# EAGLE schematic PCB Overview (EAGLE 9.2.0)
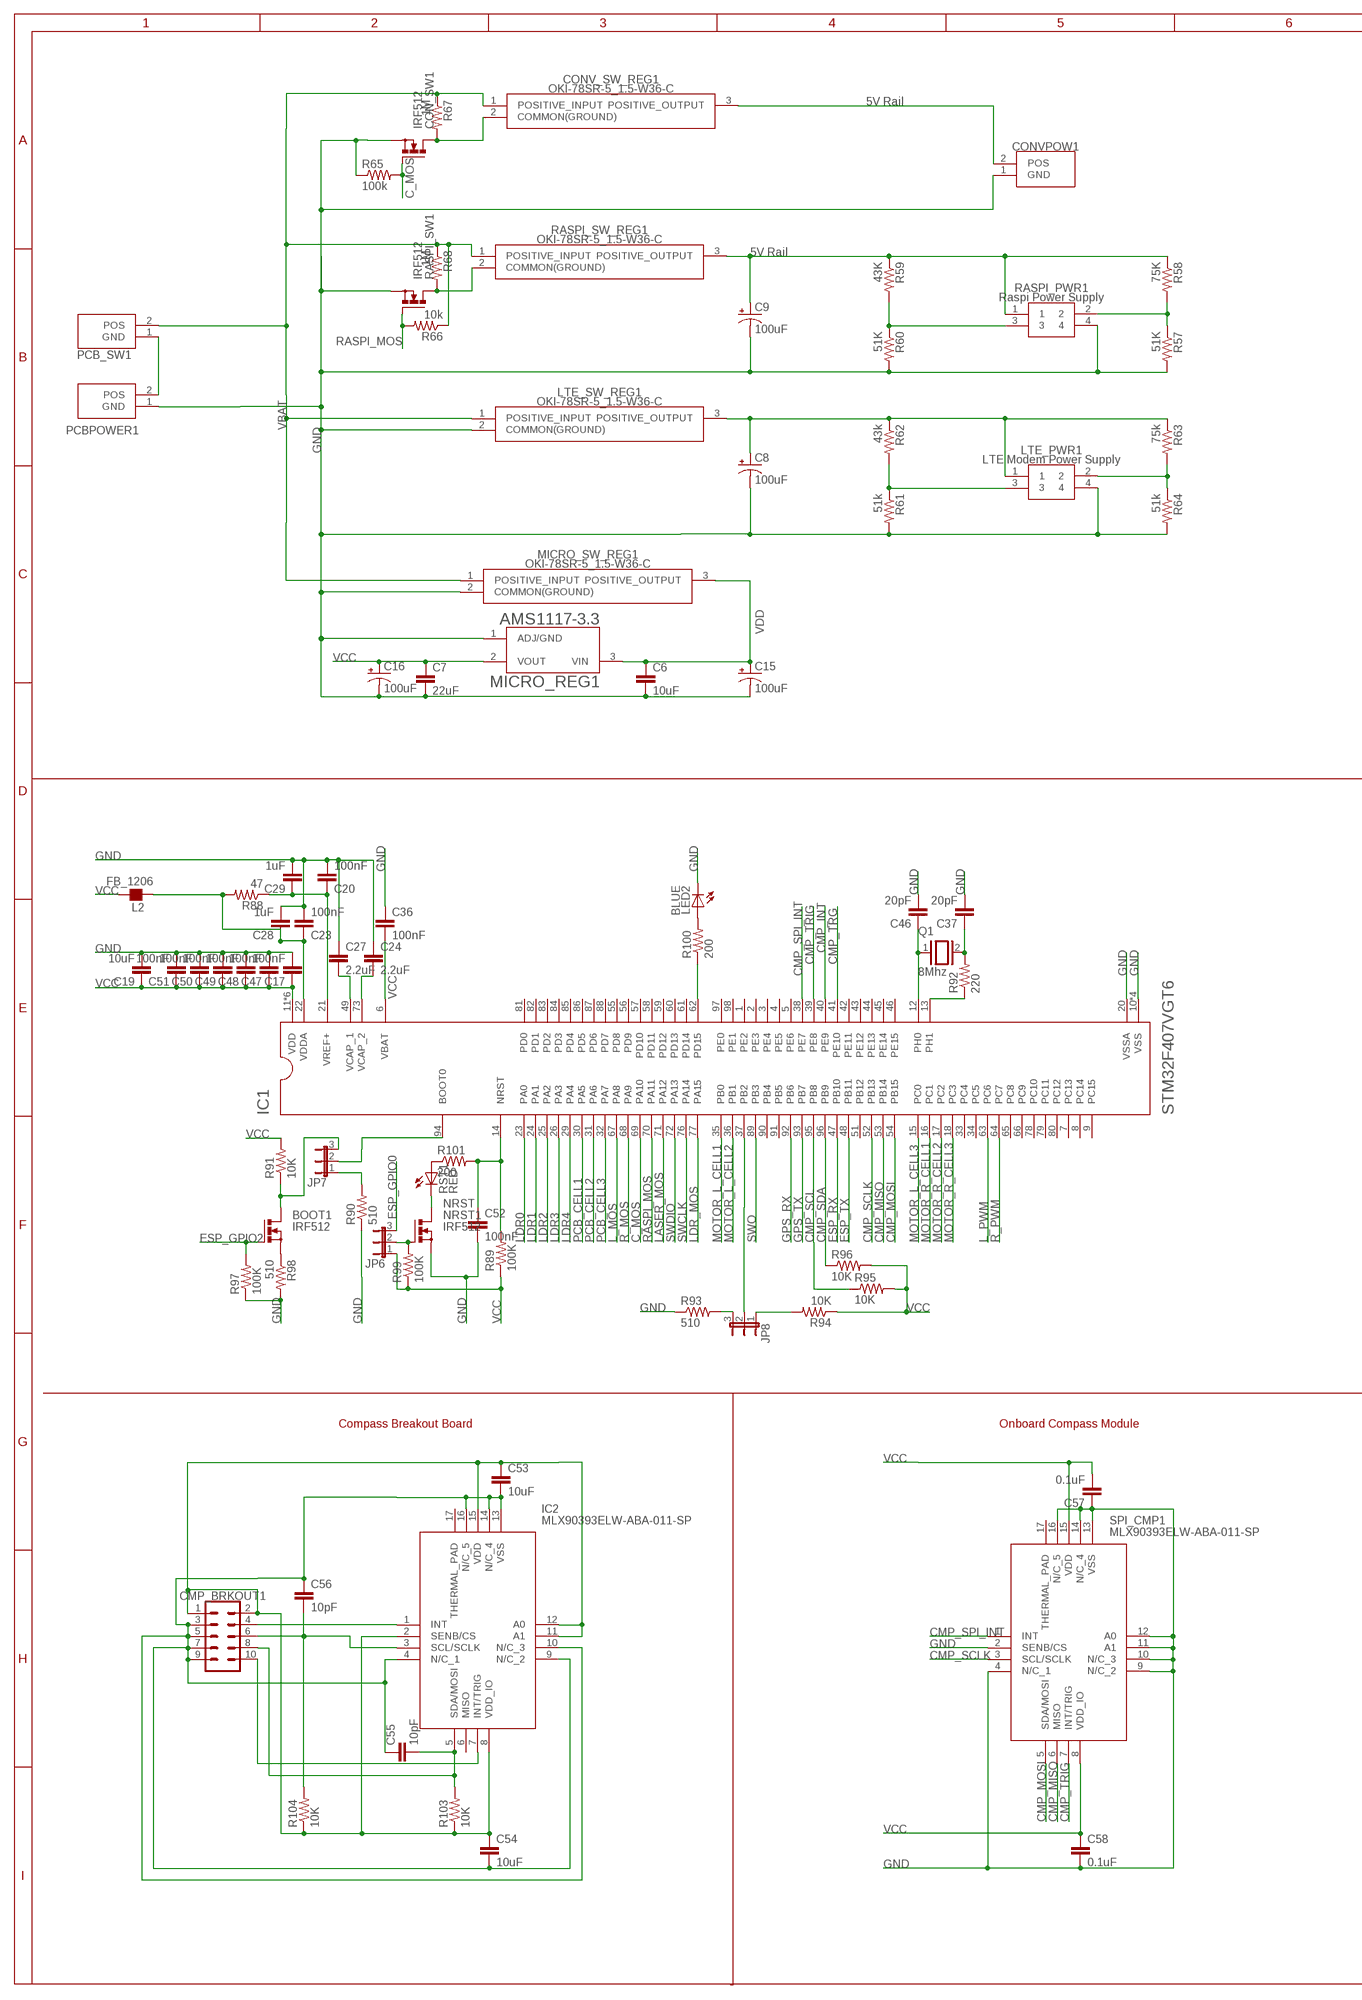
[diagram p0: schematic, sheet 1, part 1 of 2]
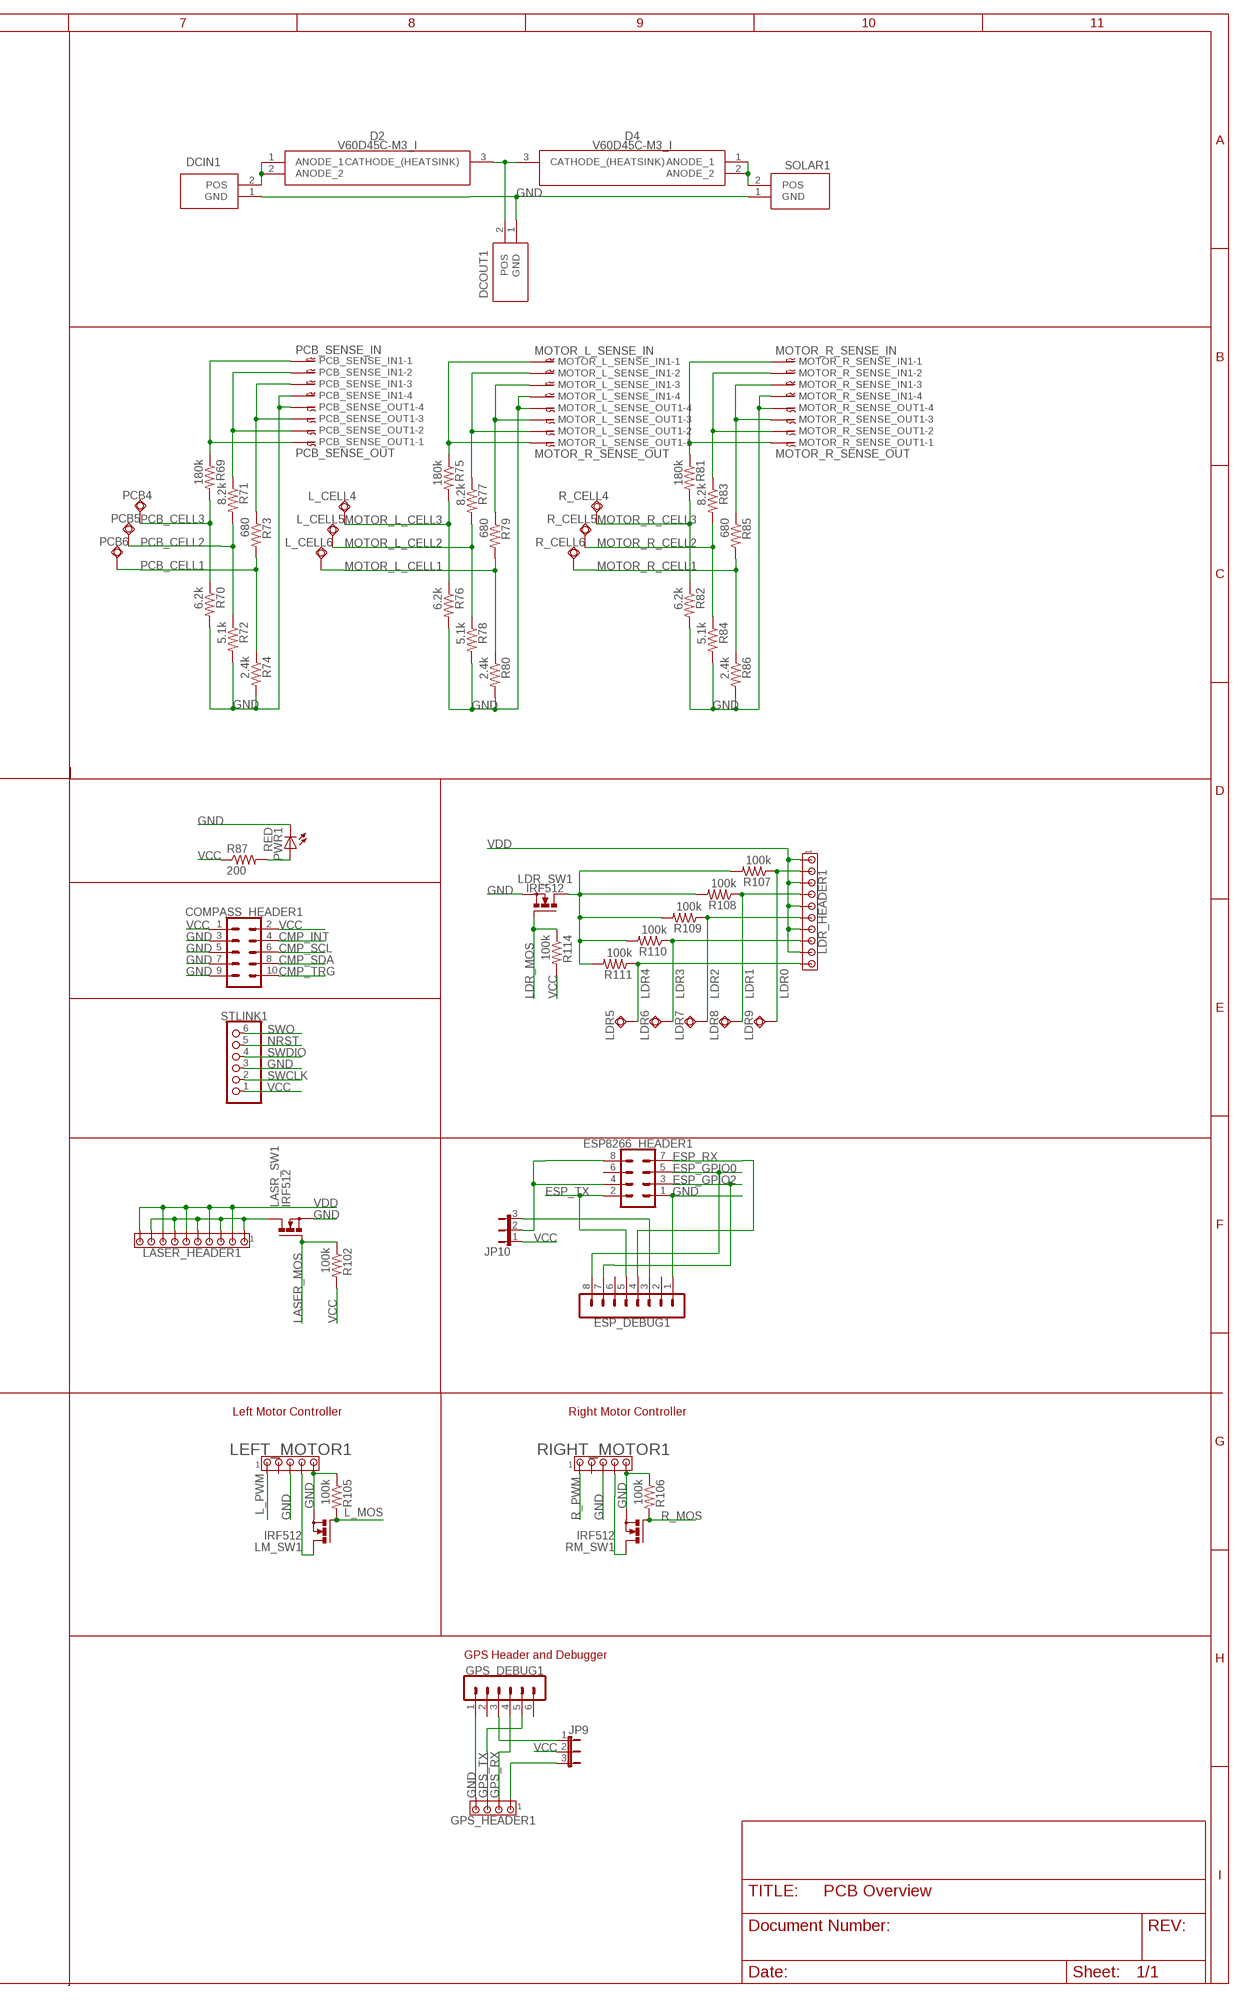
[diagram p1: schematic, sheet 1, part 2 of 2]

## Parts
BOOT1  IRF512  [TO220BV]
C6  10uF  C-EUC0805  [C0805]
C7  22uF  C-EUC0805  [C0805]
C8  100uF  CPOL-US140CLH-0810  [140CLH-0810]
C9  100uF  CPOL-US140CLH-0810  [140CLH-0810]
C15  100uF  CPOL-US140CLH-0810  [140CLH-0810]
C16  100uF  CPOL-US140CLH-0810  [140CLH-0810]
C17  100nF  C-EUC0805  [C0805]
C19  10uF  C-EUC0805  [C0805]
C20  100nF  C-EUC0805  [C0805]
C23  100nF  C-EUC0805  [C0805]
C24  2.2uF  C-EUC0805  [C0805]
C27  2.2uF  C-EUC0805  [C0805]
C28  1uF  C-EUC0805  [C0805]
C29  1uF  C-EUC0805  [C0805]
C36  100nF  C-EUC0805  [C0805]
C37  20pF  C-EUC0805  [C0805]
C46  20pF  C-EUC0805  [C0805]
C47  100nF  C-EUC0805  [C0805]
C48  100nF  C-EUC0805  [C0805]
C49  100nF  C-EUC0805  [C0805]
C50  100nF  C-EUC0805  [C0805]
C51  100nF  C-EUC0805  [C0805]
C52  100nF  C-EUC0805  [C0805]
C53  10uF  C-EUC1206  [C1206]
C54  10uF  C-EUC1206  [C1206]
C55  10pF  C-EUC1206  [C1206]
C56  10pF  C-EUC1206  [C1206]
C57  0.1uF  C-EUC1206  [C1206]
C58  0.1uF  C-EUC1206  [C1206]
CMP_BRKOUT1  CONN_05X2SHD  [2X5-SHROUDED]
COMPASS_HEADER1  CONN_05X2SHD  [2X5-SHROUDED]
CON_SW1  IRF512  [TO220BV]
CONV_SW_REG1  OKI-78SR-5_1.5-W36-C  [OKI-78SR]
CONVPOW1  PRT-10474  [SHDR2W320P716_1X2_1574X813X158]
D2  V60D45C-M3_I  [TO-263AC(SMPD)]
D4  V60D45C-M3_I  [TO-263AC(SMPD)]
DCIN1  PRT-10474  [SHDR2W320P716_1X2_1574X813X158]
DCOUT1  PRT-10474  [SHDR2W320P716_1X2_1574X813X158]
ESP8266_HEADER1  MA04-2  [MA04-2]
ESP_DEBUG1  MA08-1  [MA08-1]
GPS_DEBUG1  MA06-1  [MA06-1]
GPS_HEADER1  MTA04-100  [10X04MTA]
IC1  STM32F407VGT6  [QFP50P1600X1600X160-100N]
IC2  MLX90393ELW-ABA-011-SP  [QFN50P300X300X100-17N]
JP6  JP2E  [JP2]
JP7  JP2E  [JP2]
JP8  JP2E  [JP2]
JP9  JP2E  [JP2]
JP10  JP2E  [JP2]
L2  FB_1206  [L1206]
L_CELL4  PCB_CELL3  TPSQB2,54  [B2,54]
L_CELL5  TPSQB2,54  [B2,54]
L_CELL6  TPSQB2,54  [B2,54]
LASER_HEADER1  MTA10-100  [10X10MTA]
LASR_SW1  IRF512  [TO220BV]
LDR5  TPSQB2,54  [B2,54]
LDR6  TPSQB2,54  [B2,54]
LDR7  TPSQB2,54  [B2,54]
LDR8  TPSQB2,54  [B2,54]
LDR9  TPSQB2,54  [B2,54]
LDR_HEADER1  MTA10-100  [10X10MTA]
LDR_SW1  IRF512  [TO220BV]
LED2  BLUE  LEDCHIPLED_0805  [CHIPLED_0805]
LEFT_MOTOR1  MTA05-100  [1X05MTA]
LM_SW1  IRF512  [TO220BV]
LTE_PWR1  LTE Modem Power Supply  105057-0001  [105057-0001]
LTE_SW_REG1  OKI-78SR-5_1.5-W36-C  [OKI-78SR]
MICRO_REG1  AMS1117-3.3  [SOT229P700X180-4N]
MICRO_SW_REG1  OKI-78SR-5_1.5-W36-C  [OKI-78SR]
MOTOR_L_SENSE_IN1  MOTOR_L_SENSE_IN  04-JST-B4B-XH-A  [B4B-XH]
MOTOR_L_SENSE_OUT1  MOTOR_R_SENSE_OUT  04-JST-B4B-XH-A  [B4B-XH]
MOTOR_R_SENSE_IN1  MOTOR_R_SENSE_IN  04-JST-B4B-XH-A  [B4B-XH]
MOTOR_R_SENSE_OUT1  MOTOR_R_SENSE_OUT  04-JST-B4B-XH-A  [B4B-XH]
NRST1  IRF512  [TO220BV]
PCB4  PCB_CELL3  TPSQB2,54  [B2,54]
PCB5  TPSQB2,54  [B2,54]
PCB6  TPSQB2,54  [B2,54]
PCB_SENSE_IN1  PCB_SENSE_IN  04-JST-B4B-XH-A  [B4B-XH]
PCB_SENSE_OUT1  PCB_SENSE_OUT  04-JST-B4B-XH-A  [B4B-XH]
PCB_SW1  PRT-10474  [SHDR2W320P716_1X2_1574X813X158]
PCBPOWER1  PRT-10474  [SHDR2W320P716_1X2_1574X813X158]
PWR1  RED  LEDCHIPLED_0805  [CHIPLED_0805]
Q1  8Mhz  XTAL/S  [QS]
R57  51K  R-US_R0805  [R0805]
R58  75K  R-US_R0805  [R0805]
R59  43K  R-US_R0805  [R0805]
R60  51K  R-US_R0805  [R0805]
R61  51k  R-US_R0805  [R0805]
R62  43k  R-US_R0805  [R0805]
R63  75k  R-US_R0805  [R0805]
R64  51k  R-US_R0805  [R0805]
R65  100k  R-US_R0805  [R0805]
R66  10k  R-US_R0805  [R0805]
R67  1M  R-US_R0805  [R0805]
R68  1M  R-US_R0805  [R0805]
R69  180k  R-US_R0805  [R0805]
R70  6.2k  R-US_R0805  [R0805]
R71  8.2k  R-US_R0805  [R0805]
R72  5.1k  R-US_R0805  [R0805]
R73  680  R-US_R0805  [R0805]
R74  2.4k  R-US_R0805  [R0805]
R75  180k  R-US_R0805  [R0805]
R76  6.2k  R-US_R0805  [R0805]
R77  8.2k  R-US_R0805  [R0805]
R78  5.1k  R-US_R0805  [R0805]
R79  680  R-US_R0805  [R0805]
R80  2.4k  R-US_R0805  [R0805]
R81  180k  R-US_R0805  [R0805]
R82  6.2k  R-US_R0805  [R0805]
R83  8.2k  R-US_R0805  [R0805]
R84  5.1k  R-US_R0805  [R0805]
R85  680  R-US_R0805  [R0805]
R86  2.4k  R-US_R0805  [R0805]
R87  200  R-US_R0805  [R0805]
R88  47  R-US_R0805  [R0805]
R89  100K  R-US_R0805  [R0805]
R90  510  R-US_R0805  [R0805]
R91  10K  R-US_R0805  [R0805]
R92  220  R-US_R0805  [R0805]
R93  510  R-US_R0805  [R0805]
R94  10K  R-US_R0805  [R0805]
R95  10K  R-US_R0805  [R0805]
R96  10K  R-US_R0805  [R0805]
R97  100K  R-US_R0805  [R0805]
R98  510  R-US_R0805  [R0805]
R99  100K  R-US_R0805  [R0805]
R100  200  R-US_R0805  [R0805]
R101  200  R-US_R0805  [R0805]
R102  100k  R-US_R1206  [R1206]
R103  10K  R-US_R1206  [R1206]
R104  10K  R-US_R1206  [R1206]
R105  100k  R-US_R1206  [R1206]
R106  100k  R-US_R1206  [R1206]
R107  100k  R-US_R1206  [R1206]
R108  100k  R-US_R1206  [R1206]
R109  100k  R-US_R1206  [R1206]
R110  100k  R-US_R1206  [R1206]
R111  100k  R-US_R1206  [R1206]
R114  100k  R-US_R1206  [R1206]
R_CELL4  PCB_CELL3  TPSQB2,54  [B2,54]
R_CELL5  TPSQB2,54  [B2,54]
R_CELL6  TPSQB2,54  [B2,54]
RASPI_PWR1  Raspi Power Supply  105057-0001  [105057-0001]
RASPI_SW1  IRF512  [TO220BV]
RASPI_SW_REG1  OKI-78SR-5_1.5-W36-C  [OKI-78SR]
RIGHT_MOTOR1  MTA05-100  [1X05MTA]
RM_SW1  IRF512  [TO220BV]
RST1  RED  LEDCHIPLED_0805  [CHIPLED_0805]
SOLAR1  PRT-10474  [SHDR2W320P716_1X2_1574X813X158]
SPI_CMP1  MLX90393ELW-ABA-011-SP  [QFN50P300X300X100-17N]
STLINK1  PINHD-1X6  [1X06]

## Nets
C_MOS: CON_SW1.G IC1.69(PA10) R65.2
CMP_INT: COMPASS_HEADER1.4 IC1.40(PE9)
CMP_MISO: IC1.53(PB14) SPI_CMP1.6(MISO)
CMP_MOSI: IC1.54(PB15) SPI_CMP1.5(SDA/MOSI)
CMP_SCL: COMPASS_HEADER1.6 IC1.95(PB8) R95.1
CMP_SCLK: IC1.52(PB13) SPI_CMP1.3(SCL/SCLK)
CMP_SDA: COMPASS_HEADER1.8 IC1.96(PB9) R96.1
CMP_SPI_INT: IC1.38(PE7) SPI_CMP1.1(INT)
CMP_TRG: COMPASS_HEADER1.10 IC1.41(PE10)
CMP_TRIG: IC1.39(PE8) SPI_CMP1.7(INT/TRIG)
ESP_GPIO0: ESP8266_HEADER1.5 ESP_DEBUG1.8 JP6.3
ESP_GPIO2: BOOT1.G ESP8266_HEADER1.3 ESP_DEBUG1.7 R97.2
ESP_RX: ESP8266_HEADER1.7 ESP_DEBUG1.4 IC1.47(PB10)
ESP_TX: ESP8266_HEADER1.2 ESP_DEBUG1.5 IC1.48(PB11)
GND [power]: C6.2 C7.2 C8.- C9.- C15.- C16.- C17.2 C19.2 C20.2 C23.2 C24.1 C27.1 C28.2 C29.2 C36.1 C37.2 C46.2 C47.2 C48.2 C49.2 C50.2 C51.2 C52.2 C57.1 C58.2 COMPASS_HEADER1.3 COMPASS_HEADER1.5 COMPASS_HEADER1.7 COMPASS_HEADER1.9 CON_SW1.S CONVPOW1.1(GND) DCIN1.1(GND) DCOUT1.1(GND) ESP8266_HEADER1.1 ESP_DEBUG1.1 GPS_DEBUG1.1 GPS_HEADER1.4 IC1.10(VSS) IC1.20(VSSA) IC1.27(VSS) IC1.74(VSS) IC1.99(VSS) LASR_SW1.S LDR_SW1.S LED2.C LEFT_MOTOR1.3 LEFT_MOTOR1.5 LM_SW1.S LTE_PWR1.4 LTE_SW_REG1.2(COMMON(GROUND)) MICRO_REG1.1(ADJ/GND) MICRO_SW_REG1.2(COMMON(GROUND)) MOTOR_L_SENSE_IN1.P$4 MOTOR_L_SENSE_OUT1.P$4 MOTOR_R_SENSE_IN1.P$4 MOTOR_R_SENSE_OUT1.P$4 NRST1.S PCB_SENSE_IN1.P$4 PCB_SENSE_OUT1.P$4 PCBPOWER1.1(GND) PWR1.C R57.2 R60.2 R61.2 R64.2 R65.1 R70.2 R72.2 R74.2 R76.2 R78.2 R80.2 R82.2 R84.2 R86.2 R90.1 R93.1 R97.1 R98.2 R105.1 R106.1 RASPI_PWR1.4 RASPI_SW1.S RIGHT_MOTOR1.3 RIGHT_MOTOR1.5 RM_SW1.S SOLAR1.1(GND) SPI_CMP1.2(SENB/CS) SPI_CMP1.4(N/C_1) SPI_CMP1.9(N/C_2) SPI_CMP1.10(N/C_3) SPI_CMP1.11(A1) SPI_CMP1.12(A0) SPI_CMP1.13(VSS) SPI_CMP1.14(N/C_4) SPI_CMP1.16(N/C_5) STLINK1.3
GPS_RX: GPS_DEBUG1.4 GPS_HEADER1.2 IC1.92(PB6)
GPS_TX: GPS_DEBUG1.5 GPS_HEADER1.3 IC1.93(PB7)
L_MOS: IC1.67(PA8) LM_SW1.G R105.2
L_PWM: IC1.63(PC6) LEFT_MOTOR1.1
LASER_MOS: IC1.71(PA12) LASR_SW1.G R102.1
LDR0: IC1.23(PA0) LDR9.TP LDR_HEADER1.2 R107.1
LDR1: IC1.24(PA1) LDR8.TP LDR_HEADER1.4 R108.1
LDR2: IC1.25(PA2) LDR7.TP LDR_HEADER1.6 R109.1
LDR3: IC1.26(PA3) LDR6.TP LDR_HEADER1.8 R110.1
LDR4: IC1.29(PA4) LDR5.TP LDR_HEADER1.10 R111.1
LDR_MOS: IC1.77(PA15) LDR_SW1.G R114.1
MOTOR_L_CELL1: IC1.35(PB0) L_CELL6.TP R79.2 R80.1
MOTOR_L_CELL2: IC1.36(PB1) L_CELL5.TP R77.2 R78.1
MOTOR_L_CELL3: IC1.15(PC0) L_CELL4.TP R75.2 R76.1
MOTOR_R_CELL1: IC1.16(PC1) R85.2 R86.1 R_CELL6.TP
MOTOR_R_CELL2: IC1.17(PC2) R83.2 R84.1 R_CELL5.TP
MOTOR_R_CELL3: IC1.18(PC3) R81.2 R82.1 R_CELL4.TP
N$18 [power]: LTE_PWR1.3 R61.1 R62.2
N$31 [power]: LTE_PWR1.2 R63.2 R64.1
N$32 [power]: R59.2 R60.1 RASPI_PWR1.3
N$33 [power]: CONV_SW_REG1.3(POSITIVE_OUTPUT) CONVPOW1.2(POS)
N$42 [power]: C9.+ R58.1 R59.1 RASPI_PWR1.1 RASPI_SW_REG1.3(POSITIVE_OUTPUT)
N$53 [power]: R57.1 R58.2 RASPI_PWR1.2
N$54 [power]: C8.+ LTE_PWR1.1 LTE_SW_REG1.3(POSITIVE_OUTPUT) R62.1 R63.1
N$55: R68.2 RASPI_SW1.D RASPI_SW_REG1.2(COMMON(GROUND))
N$56: PCB_SW1.1(GND) PCBPOWER1.2(POS)
N$57 [power]: CON_SW1.D CONV_SW_REG1.2(COMMON(GROUND)) R67.2
N$58: D2.1(ANODE_1) D2.2(ANODE_2) DCIN1.2(POS)
N$59: D4.1(ANODE_1) D4.2(ANODE_2) SOLAR1.2(POS)
N$60: D2.3(CATHODE_(HEATSINK)) D4.3(CATHODE_(HEATSINK)) DCOUT1.2(POS)
N$61: PCB_SENSE_IN1.P$3 PCB_SENSE_OUT1.P$3 R73.1
N$62: PCB_SENSE_IN1.P$1 PCB_SENSE_OUT1.P$1 R69.1
N$64: PCB_SENSE_IN1.P$2 PCB_SENSE_OUT1.P$2 R71.1
N$74: MOTOR_L_SENSE_IN1.P$3 MOTOR_L_SENSE_OUT1.P$3 R79.1
N$75: MOTOR_L_SENSE_IN1.P$2 MOTOR_L_SENSE_OUT1.P$2 R77.1
N$76: MOTOR_L_SENSE_IN1.P$1 MOTOR_L_SENSE_OUT1.P$1 R75.1
N$77: MOTOR_R_SENSE_IN1.P$3 MOTOR_R_SENSE_OUT1.P$3 R85.1
N$78: MOTOR_R_SENSE_IN1.P$2 MOTOR_R_SENSE_OUT1.P$2 R83.1
N$79: MOTOR_R_SENSE_IN1.P$1 MOTOR_R_SENSE_OUT1.P$1 R81.1
N$80: PWR1.A R87.2
N$81: C27.2 IC1.49(VCAP_1)
N$82: C24.2 IC1.73(VCAP_2)
N$84: C52.1 IC1.14(NRST) R89.2 R101.2
N$85: JP6.2 NRST1.G R99.2
N$86: IC1.94(BOOT0) JP7.2
N$87: BOOT1.D JP7.3 R91.1
N$88: JP7.1 R90.2
N$89: IC1.13(PH1) R92.1
N$90: C37.1 Q1.2 R92.2
N$91: C46.1 IC1.12(PH0) Q1.1
N$92: IC1.37(PB2) JP8.2
N$93: JP8.1 R94.2
N$94: JP8.3 R93.2
N$95: BOOT1.S R98.1
N$96: IC1.62(PD15) R100.1
N$97: LED2.A R100.2
N$98: C20.1 C29.1 IC1.21(VREF+) R88.1
N$99: C23.1 C28.1 IC1.22(VDDA) L2.1 R88.2
N$100: R101.1 RST1.A
N$101: LASER_HEADER1.1 LASER_HEADER1.3 LASER_HEADER1.5 LASER_HEADER1.7 LASER_HEADER1.9 LASR_SW1.D
N$102: C53.2 C54.2 C55.1 C56.1 CMP_BRKOUT1.3 CMP_BRKOUT1.5 CMP_BRKOUT1.7 CMP_BRKOUT1.9 IC2.4(N/C_1) IC2.9(N/C_2) IC2.10(N/C_3) IC2.13(VSS) IC2.14(N/C_4) IC2.16(N/C_5)
N$103: CMP_BRKOUT1.4 IC2.1(INT)
N$104: CMP_BRKOUT1.10 IC2.7(INT/TRIG)
N$105: C53.1 C54.1 CMP_BRKOUT1.1 CMP_BRKOUT1.2 IC2.2(SENB/CS) IC2.8(VDD_IO) IC2.11(A1) IC2.12(A0) IC2.15(VDD) R103.1 R104.1
N$106: C56.2 CMP_BRKOUT1.6 IC2.3(SCL/SCLK) R104.2
N$107: C55.2 CMP_BRKOUT1.8 IC2.5(SDA/MOSI) R103.2
N$108: GPS_DEBUG1.3 JP9.1
N$109: GPS_HEADER1.1 JP9.3
N$110: LEFT_MOTOR1.4 LM_SW1.D
N$113: RIGHT_MOTOR1.4 RM_SW1.D
N$118 [power]: LDR_SW1.D R107.2 R108.2 R109.2 R110.2 R111.2
N$119: ESP8266_HEADER1.4 ESP8266_HEADER1.8 JP10.2
N$123: ESP_DEBUG1.3 JP10.3
NRST: NRST1.D RST1.C STLINK1.5
PCB_CELL1: IC1.30(PA5) PCB6.TP R73.2 R74.1
PCB_CELL2: IC1.31(PA6) PCB5.TP R71.2 R72.1
PCB_CELL3: IC1.32(PA7) PCB4.TP R69.2 R70.1
R_MOS: IC1.68(PA9) R106.2 RM_SW1.G
R_PWM: IC1.64(PC7) RIGHT_MOTOR1.1
RASPI_MOS: IC1.70(PA11) R66.2 RASPI_SW1.G
SWCLK: IC1.76(PA14) STLINK1.2
SWDIO: IC1.72(PA13) STLINK1.4
SWO: IC1.89(PB3) STLINK1.6
VBAT [power]: CONV_SW_REG1.1(POSITIVE_INPUT) LTE_SW_REG1.1(POSITIVE_INPUT) MICRO_SW_REG1.1(POSITIVE_INPUT) PCB_SW1.2(POS) R66.1 R67.1 R68.1 RASPI_SW_REG1.1(POSITIVE_INPUT)
VCC: C7.1 C16.+ C17.1 C19.1 C36.2 C47.1 C48.1 C49.1 C50.1 C51.1 C57.2 C58.1 COMPASS_HEADER1.1 COMPASS_HEADER1.2 IC1.6(VBAT) IC1.11(VDD) IC1.19(VDD) IC1.28(VDD) IC1.50(VDD) IC1.75(VDD) IC1.100(VDD) JP6.1 JP9.2 JP10.1 L2.2 MICRO_REG1.2(VOUT) R87.1 R89.1 R91.2 R94.1 R95.2 R96.2 R99.1 R102.2 R114.2 SPI_CMP1.8(VDD_IO) SPI_CMP1.15(VDD) STLINK1.1
VDD [power]: C6.1 C15.+ LASER_HEADER1.2 LASER_HEADER1.4 LASER_HEADER1.6 LASER_HEADER1.8 LASER_HEADER1.10 LDR_HEADER1.1 LDR_HEADER1.3 LDR_HEADER1.5 LDR_HEADER1.7 LDR_HEADER1.9 MICRO_REG1.3(VIN) MICRO_SW_REG1.3(POSITIVE_OUTPUT)
Unconnected: ESP8266_HEADER1.6 ESP_DEBUG1.2 ESP_DEBUG1.6 GPS_DEBUG1.2 GPS_DEBUG1.6 IC1.1(PE2) IC1.2(PE3) IC1.3(PE4) IC1.4(PE5) IC1.5(PE6) IC1.7(PC13) IC1.8(PC14) IC1.9(PC15) IC1.33(PC4) IC1.34(PC5) IC1.42(PE11) IC1.43(PE12) IC1.44(PE13) IC1.45(PE14) IC1.46(PE15) IC1.51(PB12) IC1.55(PD8) IC1.56(PD9) IC1.57(PD10) IC1.58(PD11) IC1.59(PD12) IC1.60(PD13) IC1.61(PD14) IC1.65(PC8) IC1.66(PC9) IC1.78(PC10) IC1.79(PC11) IC1.80(PC12) IC1.81(PD0) IC1.82(PD1) IC1.83(PD2) IC1.84(PD3) IC1.85(PD4) IC1.86(PD5) IC1.87(PD6) IC1.88(PD7) IC1.90(PB4) IC1.91(PB5) IC1.97(PE0) IC1.98(PE1) IC2.6(MISO) IC2.17(THERMAL_PAD) LEFT_MOTOR1.2 RIGHT_MOTOR1.2 SPI_CMP1.17(THERMAL_PAD)

## Notes on the sheet
- 5V Rail
- 5V Rail
- Left Motor Controller | Right Motor Controller
- Compass Breakout Board | Onboard Compass Module
- GPS Header and Debugger

## Library data of the parts
BOOT1 CON_SW1 LASR_SW1 LDR_SW1 LM_SW1 NRST1 RASPI_SW1 RM_SW1 = transistor-power:IRF512: N-CHANNEL MOS FET
C6 C7 C53-C58 = resistor:C-EU: CAPACITOR, European symbol
C8 C9 C15 C16 = rcl:CPOL-US: POLARIZED CAPACITOR, American symbol; SPICEPREFIX: C
C17 C19 C20 C23 C24 C27-C29 C36 C37 C46-C52 = rcl:C-EU: CAPACITOR, European symbol; SPICEPREFIX: C
CMP_BRKOUT1 COMPASS_HEADER1 = SparkFun-Connectors:CONN_05X2: Multi connection point. Often used as Generic Header-pin footprint for 0.1 inch spaced/style header connections For AVR SPI programming port, see special device with nice symbol: "AVR_SPI_PROG_5x2.dev" You can populate with any combo of single row headers, but if you'd like an exact match, check these: 2x5 AVR ICSP Male Header <https://www.sparkfun.com/products/778> (PRT-00778) 2x5 Pin Shrouded Header <https://www.sparkfun.com/products/8506> (PRT-08506) On any of the 0.1 inch spaced packages, you can populate with these: Break Away Headers - Straight <https://www.sparkfun.com/products/116> (PRT-00116) Break Away Male Headers - Right Angle <https://www.sparkfun.com/products/553> (PRT-00553) Female Headers <https://www.sparkfun.com/products/115> (PRT-00115) Break Away Headers - Machine Pin <https://www.sparkfun.com/products/117> (PRT-00117) Break Away Female Headers - Swiss Machine Pin <https://www.sparkfun.com/products/743> (PRT-00743) Special note: the shrouded connector mates well with our 5x2 ribbon cables: 2x5 Pin IDC Ribbon Cable <https://www.sparkfun.com/products/8535> (PRT-08535); PROD_ID: CONN-08671; SF_ID: PRT-08506
CONV_SW_REG1 LTE_SW_REG1 MICRO_SW_REG1 RASPI_SW_REG1 = OKI-78SR-5_1.5-W36-C:OKI-78SR-5_1.5-W36-C: Non-Isolated DC/DC Converters 7.5W 24Vin 5Vout1 1.5A SIP Non-Iso Source: Datasheet <http://docs-europe.electrocomponents.com/webdocs/13d7/0900766b813d7b66.pdf>; ARROW_PART_NUMBER: OKI-78SR-5/1.5-W36-C; ARROW_PRICE-STOCK: https://www.arrow.com/en/products/oki-78sr-51.5-w36-c/murata-power-solutions; DESCRIPTION: Non-Isolated DC/DC Converters 7.5W 24Vin 5Vout1 1.5A SIP Non-Iso; HEIGHT: mm; MANUFACTURER_NAME: Murata Electronics; MANUFACTURER_PART_NUMBER: OKI-78SR-5/1.5-W36-C; RS_PART_NUMBER: 1736928; RS_PRICE-STOCK: http://uk.rs-online.com/web/p/products/1736928
CONVPOW1 DCIN1 DCOUT1 PCB_SW1 PCBPOWER1 SOLAR1 = PRT-10474:PRT-10474: Soldering Workstation Equipment XT60 Connectors Male/Female Pair Source: Datasheet <http://cdn.sparkfun.com/datasheets/Prototyping/xt60.pdf>; ARROW_PART_NUMBER: PRT-10474; DESCRIPTION: Soldering Workstation Equipment XT60 Connectors Male/Female Pair; HEIGHT: 15.875mm; MANUFACTURER_NAME: SparkFun; MANUFACTURER_PART_NUMBER: PRT-10474
D2 D4 = V60D45C-M3_I:V60D45C-M3_I: Vishay V60D45C-M3/I, Dual SMT Schottky Diode, Common Cathode, 45V 60A, 2-Pin TO-263AC Source: Datasheet <http://uk.rs-online.com/web/p/products/8321024>; ARROW_PART_NUMBER: V60D45C-M3/I; ARROW_PRICE-STOCK: https://www.arrow.com/en/products/v60d45c-m3i/vishay; DESCRIPTION: Vishay V60D45C-M3/I, Dual SMT Schottky Diode, Common Cathode, 45V 60A, 2-Pin TO-263AC; HEIGHT: mm; MANUFACTURER_NAME: Vishay; MANUFACTURER_PART_NUMBER: V60D45C-M3/I; RS_PART_NUMBER: 8321024; RS_PRICE-STOCK: http://uk.rs-online.com/web/p/products/8321024
ESP8266_HEADER1 = con-lstb:MA04-2: PIN HEADER; OC_FARNELL: unknown; OC_NEWARK: unknown
ESP_DEBUG1 = con-lstb:MA08-1: PIN HEADER; OC_FARNELL: unknown; OC_NEWARK: unknown
GPS_DEBUG1 = con-lstb:MA06-1: PIN HEADER; OC_FARNELL: unknown; OC_NEWARK: unknown
GPS_HEADER1 = con-amp:MTA04-100: AMP connector
IC1 = STM32F407VGT6:STM32F407VGT6: STM32 Series 32-bit 1 MB Flash 192 kB RAM ARM Based Microcontroller - LQFP-100; AVAILABILITY: Unavailable; DESCRIPTION: STM32 Series 32-bit 1 MB Flash 192 kB RAM ARM Based Microcontroller - LQFP-100; MF: STMicroelectronics; MP: STM32F407VGT6; PACKAGE: LQFP-100 STMicroelectronics; PRICE: None
IC2 SPI_CMP1 = MLX90393ELW-ABA-011-SP:MLX90393ELW-ABA-011-SP: Board Mount Hall Effect / Magnetic Sensors Triaxis Micropower Magnetometer Source: Datasheet <https://www.melexis.com/-/media/files/documents/datasheets/mlx90393-datasheet-melexis.pdf>; ARROW_PART_NUMBER: MLX90393ELW-ABA-011-SP; DESCRIPTION: Board Mount Hall Effect / Magnetic Sensors Triaxis Micropower Magnetometer; HEIGHT: 1mm; MANUFACTURER_NAME: Melexis; MANUFACTURER_PART_NUMBER: MLX90393ELW-ABA-011-SP
JP6-JP10 = jumper:JP2E: JUMPER
L2 = rc-master-smd:FB_: FERRITE BEAD
L_CELL4-L_CELL6 LDR5-LDR9 PCB4-PCB6 R_CELL4-R_CELL6 = testpad:TPSQ: Test pad
LASER_HEADER1 LDR_HEADER1 = con-amp:MTA10-100: AMP connector
LED2 PWR1 RST1 = led:LED: LED OSRAM: - CHIPLED LG R971, LG N971, LY N971, LG Q971, LY Q971, LO R971, LY R971 LH N974, LH R974 LS Q976, LO Q976, LY Q976 LO Q996 - Hyper CHIPLED LW Q18S LB Q993, LB Q99A, LB R99A - SideLED LS A670, LO A670, LY A670, LG A670, LP A670 LB A673, LV A673, LT A673, LW A673 LH A674 LY A675 LS A676, LA A676, LO A676, LY A676, LW A676 LS A679, LY A679, LG A679 - Hyper Micro SIDELED® LS Y876, LA Y876, LO Y876, LY Y876 LT Y87S - SmartLED LW L88C, LW L88S LB L89C, LB L89S, LG L890 LS L89K, LO L89K, LY L89K LS L896, LA L896, LO L896, LY L896 - TOPLED LS T670, LO T670, LY T670, LG T670, LP T670 LSG T670, LSP T670, LSY T670, LOP T670, LYG T670 LG T671, LOG T671, LSG T671 LB T673, LV T673, LT T673, LW T673 LH T674 LS T676, LA T676, LO T676, LY T676, LB T676, LH T676, LSB T676, LW T676 LB T67C, LV T67C, LT T67C, LS T67K, LO T67K, LY T67K, LW E67C LS E67B, LA E67B, LO E67B, LY E67B, LB E67C, LV E67C, LT E67C LW T67C LS T679, LY T679, LG T679 LS T770, LO T770, LY T770, LG T770, LP T770 LB T773, LV T773, LT T773, LW T773 LH T774 LS E675, LA E675, LY E675, LS T675 LS T776, LA T776, LO T776, LY T776, LB T776 LHGB T686 LT T68C, LB T68C - Hyper Mini TOPLED® LB M676 - Mini TOPLED Santana® LG M470 LS M47K, LO M47K, LY M47K Source: http://www.osram.convergy.de LUXEON: - LUMILED® LXK2-PW12-R00, LXK2-PW12-S00, LXK2-PW14-U00, LXK2-PW14-V00 LXK2-PM12-R00, LXK2-PM12-S00, LXK2-PM14-U00 LXK2-PE12-Q00, LXK2-PE12-R00, LXK2-PE12-S00, LXK2-PE14-T00, LXK2-PE14-U00 LXK2-PB12-K00, LXK2-PB12-L00, LXK2-PB12-M00, LXK2-PB14-N00, LXK2-PB14-P00, LXK2-PB14-Q00 LXK2-PR12-L00, LXK2-PR12-M00, LXK2-PR14-Q00, LXK2-PR14-R00 LXK2-PD12-Q00, LXK2-PD12-R00, LXK2-PD12-S00 LXK2-PH12-R00, LXK2-PH12-S00 LXK2-PL12-P00, LXK2-PL12-Q00, LXK2-PL12-R00 Source: www.luxeon.com KINGBRIGHT: KA-3528ASYC Source: www.kingbright.com
LEFT_MOTOR1 RIGHT_MOTOR1 = AMP_MTA:MTA05-100
LTE_PWR1 RASPI_PWR1 = MOLEX_USB:105057-0001: Type A 2.0mm shielded USB PCB receptacle Molex 105057 Series, Vertical Version 2.0 Type A USB Connector, Through Hole Socket, 30 V, 1.5A Source: Datasheet <http://www.mouser.com/ds/2/276/1050570001_IO_CONNECTORS-230448.pdf>; ALLIED_NUMBER: 70747080; ALLIED_PRICE-STOCK: https://www.alliedelec.com/molex-incorporated-105057-0001/70747080/; ARROW_PART_NUMBER: 105057-0001; ARROW_PRICE-STOCK: http://uk.rs-online.com/web/p/products/8967579; DESCRIPTION: Type A 2.0mm shielded USB PCB receptacle Molex 105057 Series, Vertical Version 2.0 Type A USB Connector, Through Hole Socket, 30 V, 1.5A; HEIGHT: mm; MANUFACTURER_NAME: Molex; MANUFACTURER_PART_NUMBER: 105057-0001; RS_PART_NUMBER: 8967579; RS_PRICE-STOCK: http://uk.rs-online.com/web/p/products/8967579
MICRO_REG1 = AMS1117-3.3:AMS1117-3.3: Sot223/Pkg 1-Amp 3.3-Volt Low Drop Out Voltage Regulatator; AVAILABILITY: Unavailable; DESCRIPTION: Sot223/Pkg 1-Amp 3.3-Volt Low Drop Out Voltage Regulatator; MF: Advanced Monolithic Systems; MP: AMS1117-3.3; PACKAGE: None; PRICE: None
MOTOR_L_SENSE_IN1 MOTOR_L_SENSE_OUT1 MOTOR_R_SENSE_IN1 MOTOR_R_SENSE_OUT1 PCB_SENSE_IN1 PCB_SENSE_OUT1 = bt_con-jst-xh:04-JST: JST CONNECTOR
Q1 = special:XTAL/S: CRYSTAL
R57-R86 R102-R111 R114 = resistor:R-US_: RESISTOR, American symbol
R87-R101 = rcl:R-US_: RESISTOR, American symbol; SPICEPREFIX: R
STLINK1 = pinhead:PINHD-1X6: PIN HEADER

## Net classes
0 default: width 0.254 mm